# EAGLE design Freedom Proto v2 (EAGLE 9.6.2)
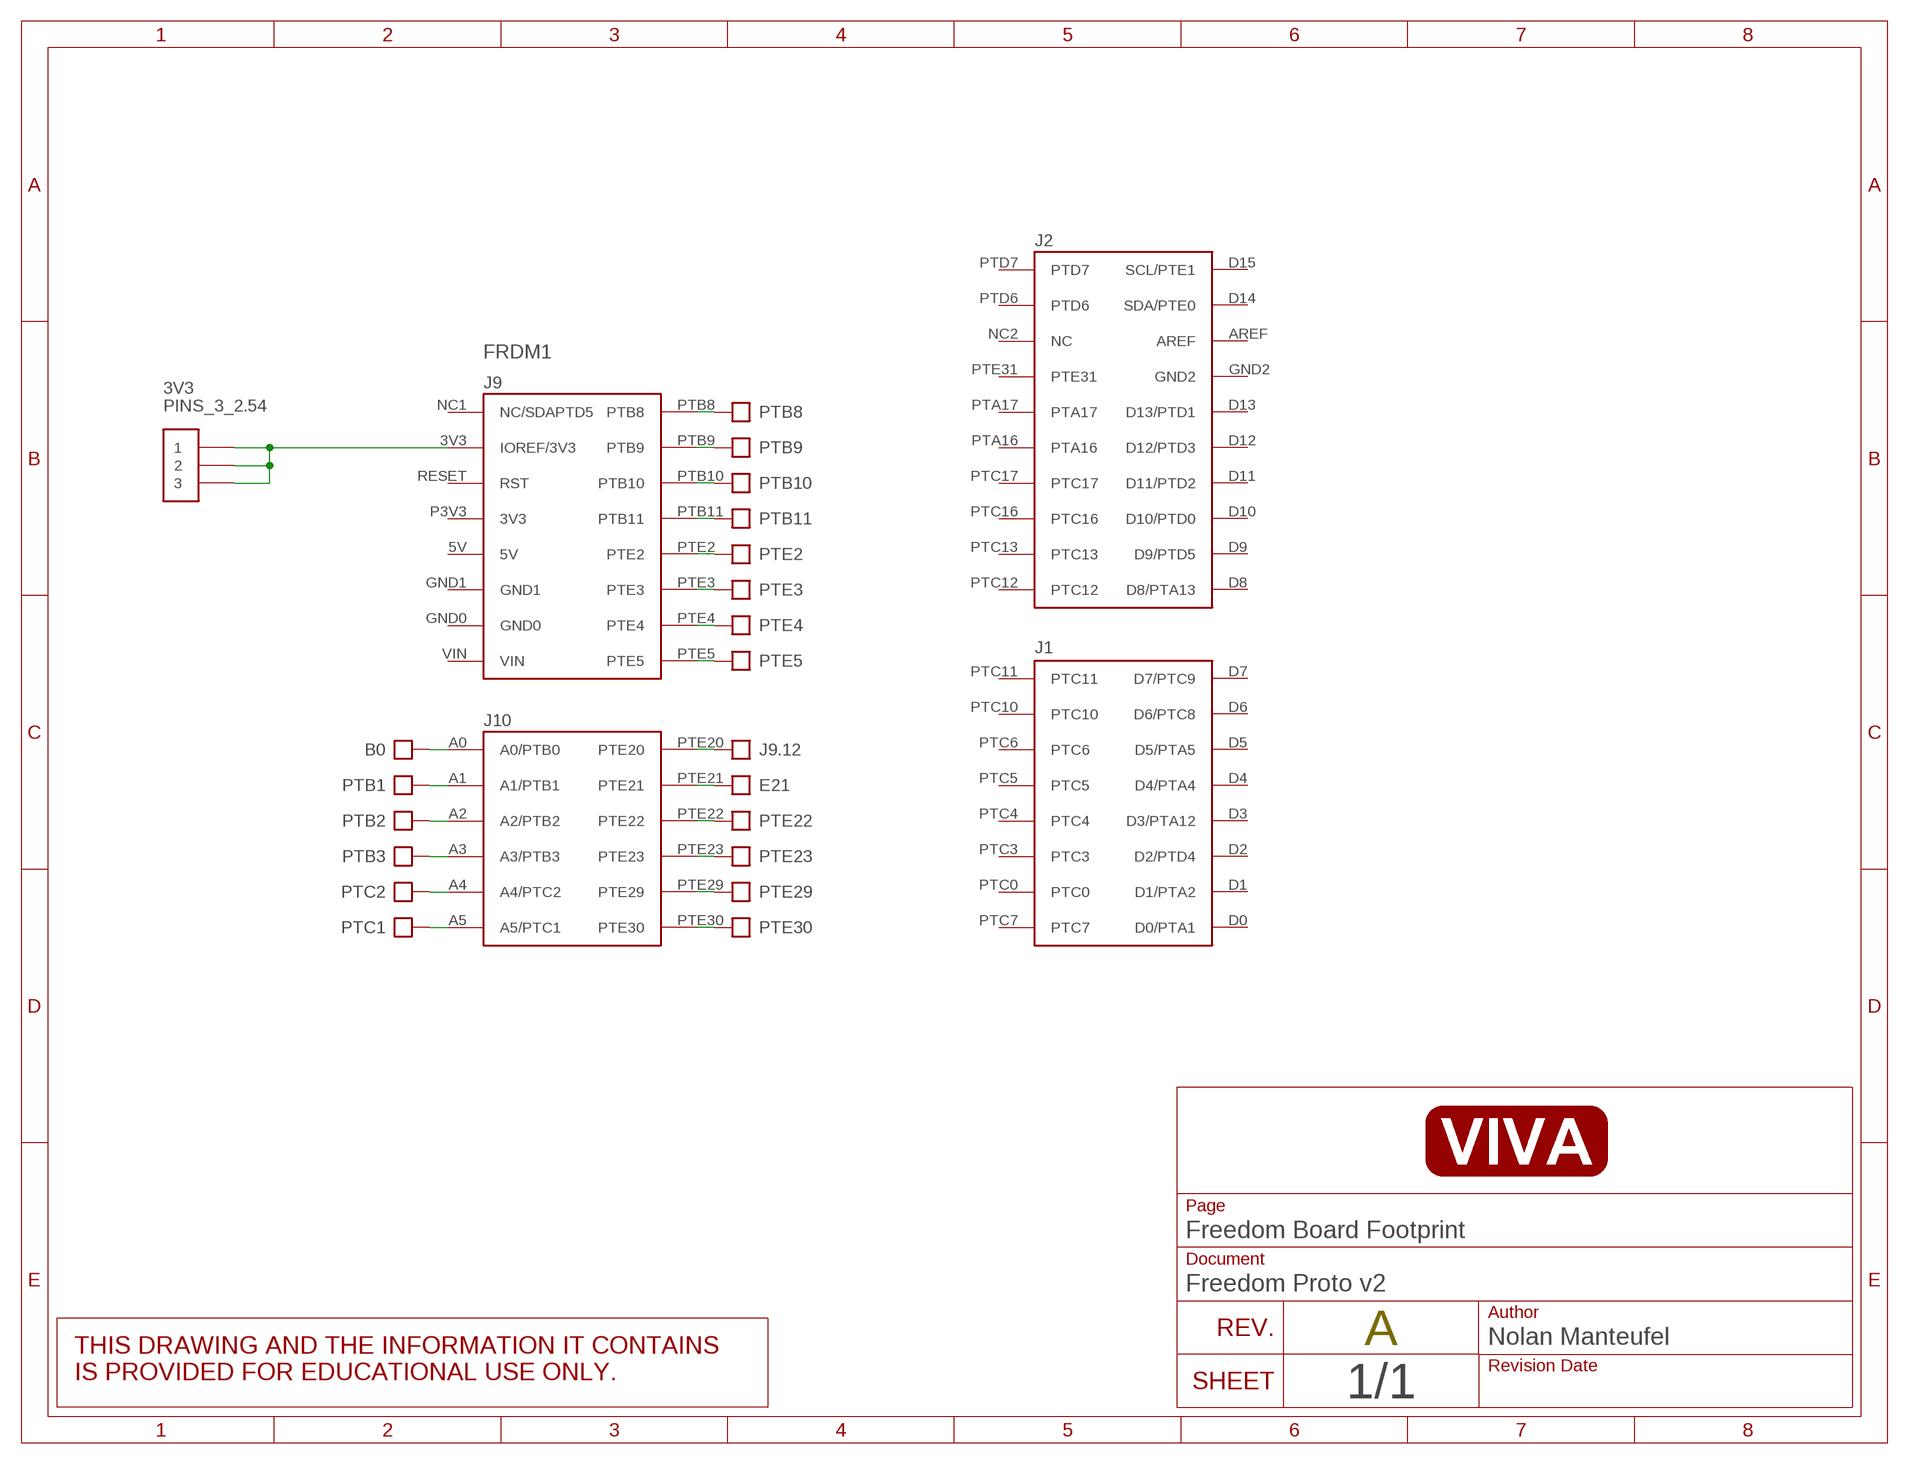
[diagram p0: schematic, sheet 1]

## Parts
3V3  PINS_3_2.54  [PINS_3]
B0  PINS_1  [PINS_1_TEXT]
E21  PINS_1  [PINS_1_TEXT]
FRDM1  FRDM-KL25ZNORMAL  [FRDM_KL25Z_NORMAL]
J9.12  PINS_1  [PINS_1_TEXT]
PTB1  PINS_1  [PINS_1_TEXT]
PTB2  PINS_1  [PINS_1_TEXT]
PTB3  PINS_1  [PINS_1_TEXT]
PTB8  PINS_1  [PINS_1_TEXT]
PTB9  PINS_1  [PINS_1_TEXT]
PTB10  PINS_1  [PINS_1_TEXT]
PTB11  PINS_1  [PINS_1_TEXT]
PTC1  PINS_1  [PINS_1_TEXT]
PTC2  PINS_1  [PINS_1_TEXT]
PTE2  PINS_1  [PINS_1_TEXT]
PTE3  PINS_1  [PINS_1_TEXT]
PTE4  PINS_1  [PINS_1_TEXT]
PTE5  PINS_1  [PINS_1_TEXT]
PTE22  PINS_1  [PINS_1_TEXT]
PTE23  PINS_1  [PINS_1_TEXT]
PTE29  PINS_1  [PINS_1_TEXT]
PTE30  PINS_1  [PINS_1_TEXT]

## Nets
N$21: B0.1 FRDM1.A0(A0/PTB0)
N$23: FRDM1.A1(A1/PTB1) PTB1.1
N$25: FRDM1.A2(A2/PTB2) PTB2.1
N$27: FRDM1.A3(A3/PTB3) PTB3.1
N$49: FRDM1.A5(A5/PTC1) PTC1.1
N$50: FRDM1.PTE20 J9.12.1
N$51: E21.1 FRDM1.PTE21
N$52: FRDM1.PTE22 PTE22.1
N$53: FRDM1.PTE23 PTE23.1
N$54: FRDM1.PTE29 PTE29.1
N$55: FRDM1.PTE30 PTE30.1
N$56: FRDM1.A4(A4/PTC2) PTC2.1
N$295: 3V3.1 3V3.2 3V3.3 FRDM1.3V3(IOREF/3V3)
N$298: FRDM1.PTB8 PTB8.1
N$299: FRDM1.PTB9 PTB9.1
N$302: FRDM1.PTB10 PTB10.1
N$303: FRDM1.PTB11 PTB11.1
N$306: FRDM1.PTE2 PTE2.1
N$308: FRDM1.PTE3 PTE3.1
N$310: FRDM1.PTE4 PTE4.1
N$312: FRDM1.PTE5 PTE5.1
Unconnected: FRDM1.5V FRDM1.AREF FRDM1.D0(D0/PTA1) FRDM1.D1(D1/PTA2) FRDM1.D2(D2/PTD4) FRDM1.D3(D3/PTA12) FRDM1.D4(D4/PTA4) FRDM1.D5(D5/PTA5) FRDM1.D6(D6/PTC8) FRDM1.D7(D7/PTC9) FRDM1.D8(D8/PTA13) FRDM1.D9(D9/PTD5) FRDM1.D10(D10/PTD0) FRDM1.D11(D11/PTD2) FRDM1.D12(D12/PTD3) FRDM1.D13(D13/PTD1) FRDM1.D14(SDA/PTE0) FRDM1.D15(SCL/PTE1) FRDM1.GND0 FRDM1.GND1 FRDM1.GND2 FRDM1.NC1(NC/SDAPTD5) FRDM1.NC2(NC) FRDM1.P3V3(3V3) FRDM1.PTA16 FRDM1.PTA17 FRDM1.PTC0 FRDM1.PTC3 FRDM1.PTC4 FRDM1.PTC5 FRDM1.PTC6 FRDM1.PTC7 FRDM1.PTC10 FRDM1.PTC11 FRDM1.PTC12 FRDM1.PTC13 FRDM1.PTC16 FRDM1.PTC17 FRDM1.PTD6 FRDM1.PTD7 FRDM1.PTE31 FRDM1.RESET(RST) FRDM1.VIN

## Library data of the parts
3V3 = nolan-utsa:PINS_3
B0 E21 J9.12 PTB1-PTB3 PTB8-PTB11 PTC1 PTC2 PTE2-PTE5 PTE22 PTE23 PTE29 PTE30 = nolan-utsa:PINS_1
FRDM1 = nolan-utsa:FRDM-KL25Z: For creating FRDM-KL25Z shields

## Board
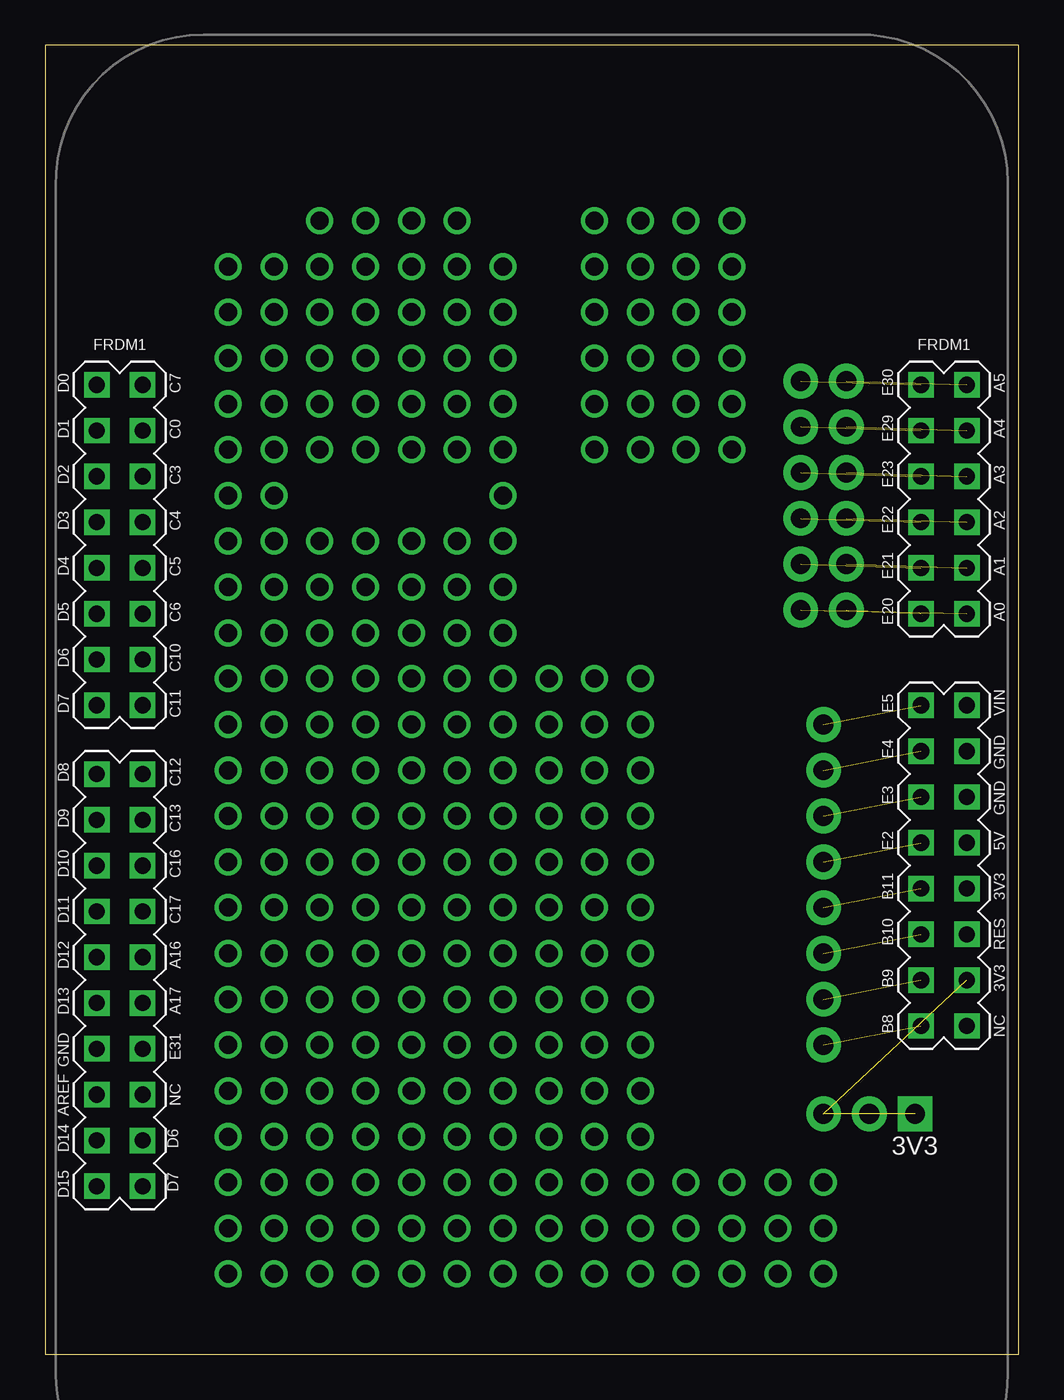
[diagram p1: board, top side]

Size 54 x 72.62 mm. Coordinates in mm from the lower left corner, seen from the top.
Outline: 0,0 54,0 54,72.62 0,72.62 0,0
Copper layers (1*16): Top 0.035mm / dielectric 1.5mm / Bottom 0.035mm
Design rules "default": minimum track width 6mil, minimum drill 0.35mm, track to track 6mil, track to pad 6mil, pad to pad 6mil, via to via 6mil, smd to smd 6mil, copper to edge 40mil, drill to drill 6mil, minimum pad ring 10mil, minimum via ring 8mil, stop-mask expansion 4mil, vias tented up to drill 0mil, thermal gap 10mil

### Footprints (pad centres in the part's own frame; a part is rotated, then mirrored left to right if it is on the bottom)
PINS_3 = drill 1.1 pad 1.93 square: 1 0,0 | drill 1.1 pad 1.93: 2 2.54,0; 3 5.08,0
PINS_1_TEXT = drill 1.1 pad 1.93: 1 0,0
FRDM_KL25Z_NORMAL = drill 0.9 square: 3V3 24.13,-15.24; 5V 24.13,-7.62; A0 24.13,5.08; A1 24.13,7.62; A2 24.13,10.16; A3 24.13,12.7; A4 24.13,15.24; A5 24.13,17.78; AREF -24.13,-21.59; D0 -24.13,17.78; D1 -24.13,15.24; D2 -24.13,12.7; D3 -24.13,10.16; D4 -24.13,7.62; D5 -24.13,5.08; D6 -24.13,2.54; D7 -24.13,0; D8 -24.13,-3.81; D9 -24.13,-6.35; D10 -24.13,-8.89; D11 -24.13,-11.43; D12 -24.13,-13.97; D13 -24.13,-16.51; D14 -24.13,-24.13; D15 -24.13,-26.67; GND0 24.13,-2.54; GND1 24.13,-5.08; GND2 -24.13,-19.05; NC1 24.13,-17.78; NC2 -21.59,-21.59; P3V3 24.13,-10.16; PTA16 -21.59,-13.97; PTA17 -21.59,-16.51; PTB8 21.59,-17.78; PTB9 21.59,-15.24; PTB10 21.59,-12.7; PTB11 21.59,-10.16; PTC0 -21.59,15.24; PTC3 -21.59,12.7; PTC4 -21.59,10.16; PTC5 -21.59,7.62; PTC6 -21.59,5.08; PTC7 -21.59,17.78; PTC10 -21.59,2.54; PTC11 -21.59,0; PTC12 -21.59,-3.81; PTC13 -21.59,-6.35; PTC16 -21.59,-8.89; PTC17 -21.59,-11.43; PTD6 -21.59,-24.13; PTD7 -21.59,-26.67; PTE2 21.59,-7.62; PTE3 21.59,-5.08; PTE4 21.59,-2.54; PTE5 21.59,0; PTE20 21.59,5.08; PTE21 21.59,7.62; PTE22 21.59,10.16; PTE23 21.59,12.7; PTE29 21.59,15.24; PTE30 21.59,17.78; PTE31 -21.59,-19.05; RESET 24.13,-12.7; VIN 24.13,0

### Placement (x,y rotation side)
3V3  48.26,13.35 180 top
B0  41.91,41.29 180 top
E21  41.91,43.83 180 top
FRDM1  27,36 0 top
J9.12  44.45,41.29 180 top
PTB1  44.45,43.83 180 top
PTB2  44.45,46.37 180 top
PTB3  44.45,48.91 180 top
PTB8  43.18,17.16 180 top
PTB9  43.18,19.7 180 top
PTB10  43.18,22.24 180 top
PTB11  43.18,24.78 180 top
PTC1  44.45,53.99 180 top
PTC2  44.45,51.45 180 top
PTE2  43.18,27.32 180 top
PTE3  43.18,29.86 180 top
PTE4  43.18,32.4 180 top
PTE5  43.18,34.94 180 top
PTE22  41.91,46.37 180 top
PTE23  41.91,48.91 180 top
PTE29  41.91,51.45 180 top
PTE30  41.91,53.99 180 top

### Tracks (layer width: path | path; a pad name or v marks a point on that pad's centre or on a via)
N$1  (via drill 1)
  other vias: 10.16,9.54
N$2  (via drill 1)
  other vias: 10.16,12.08
N$3  (via drill 1)
  other vias: 12.7,12.08
N$4  (via drill 1)
  other vias: 12.7,9.54
N$5  (via drill 1)
  other vias: 15.24,9.54
N$6  (via drill 1)
  other vias: 15.24,12.08
N$7  (via drill 1)
  other vias: 17.78,12.08
N$8  (via drill 1)
  other vias: 17.78,9.54
N$9  (via drill 1)
  other vias: 20.32,9.54
N$10  (via drill 1)
  other vias: 20.32,12.08
N$11  (via drill 1)
  other vias: 22.86,12.08
N$12  (via drill 1)
  other vias: 22.86,9.54
N$13  (via drill 1)
  other vias: 25.4,12.08
N$14  (via drill 1)
  other vias: 25.4,9.54
N$15  (via drill 1)
  other vias: 27.94,12.08
N$16  (via drill 1)
  other vias: 27.94,9.54
N$17  (via drill 1)
  other vias: 30.48,12.08
N$18  (via drill 1)
  other vias: 30.48,9.54
N$19  (via drill 1)
  other vias: 33.02,12.08
N$20  (via drill 1)
  other vias: 33.02,9.54
N$21  (1 unrouted)
N$22  (via drill 1)
  other vias: 35.56,9.54
N$23  (1 unrouted)
N$24  (via drill 1)
  other vias: 38.1,9.54
N$25  (1 unrouted)
N$26  (via drill 1)
  other vias: 40.64,9.54
N$27  (1 unrouted)
N$28  (via drill 1)
  other vias: 43.18,9.54
N$29  (via drill 1)
  other vias: 10.16,14.62
N$30  (via drill 1)
  other vias: 10.16,17.16
N$31  (via drill 1)
  other vias: 12.7,17.16
N$32  (via drill 1)
  other vias: 12.7,14.62
N$33  (via drill 1)
  other vias: 15.24,14.62
N$34  (via drill 1)
  other vias: 15.24,17.16
N$35  (via drill 1)
  other vias: 17.78,17.16
N$36  (via drill 1)
  other vias: 17.78,14.62
N$37  (via drill 1)
  other vias: 20.32,14.62
N$38  (via drill 1)
  other vias: 20.32,17.16
N$39  (via drill 1)
  other vias: 22.86,17.16
N$40  (via drill 1)
  other vias: 22.86,14.62
N$41  (via drill 1)
  other vias: 25.4,17.16
N$42  (via drill 1)
  other vias: 25.4,14.62
N$43  (via drill 1)
  other vias: 27.94,17.16
N$44  (via drill 1)
  other vias: 27.94,14.62
N$45  (via drill 1)
  other vias: 30.48,17.16
N$46  (via drill 1)
  other vias: 30.48,14.62
N$47  (via drill 1)
  other vias: 33.02,17.16
N$48  (via drill 1)
  other vias: 33.02,14.62
N$49  (1 unrouted)
N$50  (1 unrouted)
N$51  (1 unrouted)
N$52  (1 unrouted)
N$53  (1 unrouted)
N$54  (1 unrouted)
N$55  (1 unrouted)
N$56  (1 unrouted)
N$57  (via drill 1)
  other vias: 10.16,19.7
N$58  (via drill 1)
  other vias: 10.16,22.24
N$59  (via drill 1)
  other vias: 12.7,22.24
N$60  (via drill 1)
  other vias: 12.7,19.7
N$61  (via drill 1)
  other vias: 15.24,19.7
N$62  (via drill 1)
  other vias: 15.24,22.24
N$63  (via drill 1)
  other vias: 17.78,22.24
N$64  (via drill 1)
  other vias: 17.78,19.7
N$65  (via drill 1)
  other vias: 20.32,19.7
N$66  (via drill 1)
  other vias: 20.32,22.24
N$67  (via drill 1)
  other vias: 22.86,22.24
N$68  (via drill 1)
  other vias: 22.86,19.7
N$69  (via drill 1)
  other vias: 25.4,22.24
N$70  (via drill 1)
  other vias: 25.4,19.7
N$71  (via drill 1)
  other vias: 27.94,22.24
N$72  (via drill 1)
  other vias: 27.94,19.7
N$73  (via drill 1)
  other vias: 30.48,22.24
N$74  (via drill 1)
  other vias: 30.48,19.7
N$75  (via drill 1)
  other vias: 33.02,22.24
N$76  (via drill 1)
  other vias: 33.02,19.7
N$77  (via drill 1)
  other vias: 30.48,50.18
N$78  (via drill 1)
  other vias: 33.02,50.18
N$79  (via drill 1)
  other vias: 35.56,50.18
N$80  (via drill 1)
  other vias: 38.1,50.18
N$81  (via drill 1)
  other vias: 30.48,52.72
N$82  (via drill 1)
  other vias: 33.02,52.72
N$83  (via drill 1)
  other vias: 35.56,52.72
N$84  (via drill 1)
  other vias: 38.1,52.72
N$85  (via drill 1)
  other vias: 10.16,24.78
N$86  (via drill 1)
  other vias: 10.16,27.32
N$87  (via drill 1)
  other vias: 12.7,27.32
N$88  (via drill 1)
  other vias: 12.7,24.78
N$89  (via drill 1)
  other vias: 15.24,24.78
N$90  (via drill 1)
  other vias: 15.24,27.32
N$91  (via drill 1)
  other vias: 17.78,27.32
N$92  (via drill 1)
  other vias: 17.78,24.78
N$93  (via drill 1)
  other vias: 20.32,24.78
N$94  (via drill 1)
  other vias: 20.32,27.32
N$95  (via drill 1)
  other vias: 22.86,27.32
N$96  (via drill 1)
  other vias: 22.86,24.78
N$97  (via drill 1)
  other vias: 25.4,27.32
N$98  (via drill 1)
  other vias: 25.4,24.78
N$99  (via drill 1)
  other vias: 27.94,27.32
N$100  (via drill 1)
  other vias: 27.94,24.78
N$101  (via drill 1)
  other vias: 30.48,27.32
N$102  (via drill 1)
  other vias: 30.48,24.78
N$103  (via drill 1)
  other vias: 33.02,27.32
N$104  (via drill 1)
  other vias: 33.02,24.78
N$105  (via drill 1)
  other vias: 30.48,55.26
N$106  (via drill 1)
  other vias: 30.48,57.8
N$107  (via drill 1)
  other vias: 33.02,57.8
N$108  (via drill 1)
  other vias: 33.02,55.26
N$109  (via drill 1)
  other vias: 35.56,55.26
N$110  (via drill 1)
  other vias: 35.56,57.8
N$111  (via drill 1)
  other vias: 38.1,57.8
N$112  (via drill 1)
  other vias: 38.1,55.26
N$113  (via drill 1)
  other vias: 10.16,29.86
N$114  (via drill 1)
  other vias: 10.16,32.4
N$115  (via drill 1)
  other vias: 12.7,32.4
N$116  (via drill 1)
  other vias: 12.7,29.86
N$117  (via drill 1)
  other vias: 15.24,29.86
N$118  (via drill 1)
  other vias: 15.24,32.4
N$119  (via drill 1)
  other vias: 17.78,32.4
N$120  (via drill 1)
  other vias: 17.78,29.86
N$121  (via drill 1)
  other vias: 20.32,29.86
N$122  (via drill 1)
  other vias: 20.32,32.4
N$123  (via drill 1)
  other vias: 22.86,32.4
N$124  (via drill 1)
  other vias: 22.86,29.86
N$125  (via drill 1)
  other vias: 25.4,32.4
N$126  (via drill 1)
  other vias: 25.4,29.86
N$127  (via drill 1)
  other vias: 27.94,32.4
N$128  (via drill 1)
  other vias: 27.94,29.86
N$129  (via drill 1)
  other vias: 30.48,32.4
N$130  (via drill 1)
  other vias: 30.48,29.86
N$131  (via drill 1)
  other vias: 33.02,32.4
N$132  (via drill 1)
  other vias: 33.02,29.86
N$133  (via drill 1)
  other vias: 30.48,60.34
N$134  (via drill 1)
  other vias: 30.48,62.88
N$135  (via drill 1)
  other vias: 33.02,62.88
N$136  (via drill 1)
  other vias: 33.02,60.34
N$137  (via drill 1)
  other vias: 35.56,60.34
N$138  (via drill 1)
  other vias: 35.56,62.88
N$139  (via drill 1)
  other vias: 38.1,62.88
N$140  (via drill 1)
  other vias: 38.1,60.34
N$141  (via drill 1)
  other vias: 10.16,34.94
N$142  (via drill 1)
  other vias: 10.16,37.48
N$143  (via drill 1)
  other vias: 12.7,37.48
N$144  (via drill 1)
  other vias: 12.7,34.94
N$145  (via drill 1)
  other vias: 15.24,34.94
N$146  (via drill 1)
  other vias: 15.24,37.48
N$147  (via drill 1)
  other vias: 17.78,37.48
N$148  (via drill 1)
  other vias: 17.78,34.94
N$149  (via drill 1)
  other vias: 20.32,34.94
N$150  (via drill 1)
  other vias: 20.32,37.48
N$151  (via drill 1)
  other vias: 22.86,37.48
N$152  (via drill 1)
  other vias: 22.86,34.94
N$153  (via drill 1)
  other vias: 25.4,37.48
N$154  (via drill 1)
  other vias: 25.4,34.94
N$155  (via drill 1)
  other vias: 27.94,37.48
N$156  (via drill 1)
  other vias: 27.94,34.94
N$157  (via drill 1)
  other vias: 30.48,37.48
N$158  (via drill 1)
  other vias: 30.48,34.94
N$159  (via drill 1)
  other vias: 33.02,37.48
N$160  (via drill 1)
  other vias: 33.02,34.94
N$169  (via drill 1)
  other vias: 10.16,40.02
N$170  (via drill 1)
  other vias: 10.16,42.56
N$171  (via drill 1)
  other vias: 12.7,42.56
N$172  (via drill 1)
  other vias: 12.7,40.02
N$173  (via drill 1)
  other vias: 15.24,40.02
N$174  (via drill 1)
  other vias: 15.24,42.56
N$175  (via drill 1)
  other vias: 17.78,42.56
N$176  (via drill 1)
  other vias: 17.78,40.02
N$177  (via drill 1)
  other vias: 20.32,40.02
N$178  (via drill 1)
  other vias: 20.32,42.56
N$179  (via drill 1)
  other vias: 22.86,42.56
N$180  (via drill 1)
  other vias: 22.86,40.02
N$181  (via drill 1)
  other vias: 25.4,42.56
N$182  (via drill 1)
  other vias: 25.4,40.02
N$197  (via drill 1)
  other vias: 10.16,45.1
N$198  (via drill 1)
  other vias: 10.16,47.64
N$199  (via drill 1)
  other vias: 12.7,47.64
N$200  (via drill 1)
  other vias: 12.7,45.1
N$201  (via drill 1)
  other vias: 15.24,45.1
N$202  (via drill 1)
  other vias: 15.24,50.18
N$203  (via drill 1)
  other vias: 17.78,50.18
N$204  (via drill 1)
  other vias: 17.78,45.1
N$205  (via drill 1)
  other vias: 20.32,45.1
N$206  (via drill 1)
  other vias: 20.32,50.18
N$207  (via drill 1)
  other vias: 22.86,50.18
N$208  (via drill 1)
  other vias: 22.86,45.1
N$209  (via drill 1)
  other vias: 25.4,47.64
N$210  (via drill 1)
  other vias: 25.4,45.1
N$225  (via drill 1)
  other vias: 10.16,50.18
N$226  (via drill 1)
  other vias: 12.7,50.18
N$227  (via drill 1)
  other vias: 15.24,52.72
N$228  (via drill 1)
  other vias: 17.78,52.72
N$229  (via drill 1)
  other vias: 20.32,52.72
N$230  (via drill 1)
  other vias: 22.86,52.72
N$231  (via drill 1)
  other vias: 25.4,50.18
N$239  (via drill 1)
  other vias: 10.16,52.72
N$240  (via drill 1)
  other vias: 10.16,55.26
N$241  (via drill 1)
  other vias: 12.7,55.26
N$242  (via drill 1)
  other vias: 12.7,52.72
N$243  (via drill 1)
  other vias: 15.24,55.26
N$244  (via drill 1)
  other vias: 15.24,57.8
N$245  (via drill 1)
  other vias: 17.78,57.8
N$246  (via drill 1)
  other vias: 17.78,55.26
N$247  (via drill 1)
  other vias: 20.32,55.26
N$248  (via drill 1)
  other vias: 20.32,57.8
N$249  (via drill 1)
  other vias: 22.86,57.8
N$250  (via drill 1)
  other vias: 22.86,55.26
N$251  (via drill 1)
  other vias: 25.4,55.26
N$252  (via drill 1)
  other vias: 25.4,52.72
N$267  (via drill 1)
  other vias: 10.16,57.8
N$268  (via drill 1)
  other vias: 10.16,60.34
N$269  (via drill 1)
  other vias: 12.7,60.34
N$270  (via drill 1)
  other vias: 12.7,57.8
N$271  (via drill 1)
  other vias: 15.24,60.34
N$272  (via drill 1)
  other vias: 15.24,62.88
N$273  (via drill 1)
  other vias: 17.78,62.88
N$274  (via drill 1)
  other vias: 17.78,60.34
N$275  (via drill 1)
  other vias: 20.32,60.34
N$276  (via drill 1)
  other vias: 20.32,62.88
N$277  (via drill 1)
  other vias: 22.86,62.88
N$278  (via drill 1)
  other vias: 22.86,60.34
N$279  (via drill 1)
  other vias: 25.4,60.34
N$280  (via drill 1)
  other vias: 25.4,57.8
N$295  (3 unrouted)
N$296  (via drill 1)
  other vias: 10.16,4.46
N$297  (via drill 1)
  other vias: 12.7,4.46
N$298  (1 unrouted)
N$299  (1 unrouted)
N$300  (via drill 1)
  other vias: 15.24,4.46
N$301  (via drill 1)
  other vias: 17.78,4.46
N$302  (1 unrouted)
N$303  (1 unrouted)
N$304  (via drill 1)
  other vias: 20.32,4.46
N$305  (via drill 1)
  other vias: 22.86,4.46
N$306  (1 unrouted)
N$307  (via drill 1)
  other vias: 25.4,4.46
N$308  (1 unrouted)
N$309  (via drill 1)
  other vias: 27.94,4.46
N$310  (1 unrouted)
N$311  (via drill 1)
  other vias: 30.48,4.46
N$312  (1 unrouted)
N$313  (via drill 1)
  other vias: 33.02,4.46
N$315  (via drill 1)
  other vias: 35.56,4.46
N$317  (via drill 1)
  other vias: 38.1,4.46
N$319  (via drill 1)
  other vias: 40.64,4.46
N$321  (via drill 1)
  other vias: 43.18,4.46
N$323  (via drill 1)
  other vias: 10.16,7
N$324  (via drill 1)
  other vias: 12.7,7
N$325  (via drill 1)
  other vias: 15.24,7
N$326  (via drill 1)
  other vias: 17.78,7
N$327  (via drill 1)
  other vias: 20.32,7
N$328  (via drill 1)
  other vias: 22.86,7
N$329  (via drill 1)
  other vias: 25.4,7
N$330  (via drill 1)
  other vias: 27.94,7
N$331  (via drill 1)
  other vias: 30.48,7
N$332  (via drill 1)
  other vias: 33.02,7
N$333  (via drill 1)
  other vias: 35.56,7
N$334  (via drill 1)
  other vias: 38.1,7
N$335  (via drill 1)
  other vias: 40.64,7
N$336  (via drill 1)
  other vias: 43.18,7